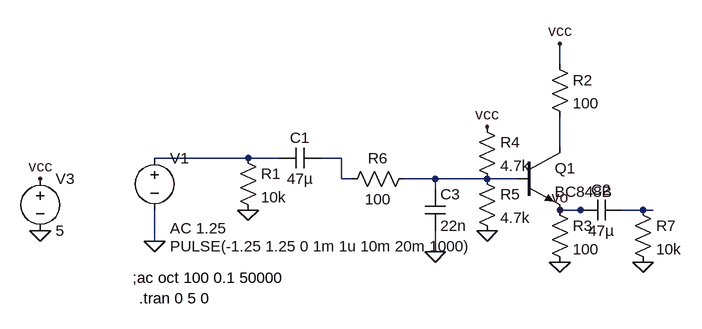
[diagram p0: schematic bandpass-emiterfollower.asc]
bandpass-emiterfollower.asc, the LTspice schematic file:
Version 4
SHEET 1 1756 680
WIRE 592 -80 592 -112
WIRE 592 48 592 0
WIRE 112 64 -32 64
WIRE 160 64 112 64
WIRE 256 64 224 64
WIRE 256 96 256 64
WIRE 272 96 256 96
WIRE 400 96 352 96
WIRE 480 96 400 96
WIRE 528 96 480 96
WIRE 400 112 400 96
WIRE 624 144 592 144
WIRE 640 144 624 144
WIRE 720 144 688 144
WIRE 736 144 720 144
WIRE -32 192 -32 144
WIRE 400 208 400 176
FLAG 592 144 vo
FLAG -32 192 0
FLAG 592 224 0
FLAG 592 -112 vcc
FLAG -208 176 0
FLAG -208 96 vcc
FLAG 480 176 0
FLAG 480 16 vcc
FLAG 112 144 0
FLAG 400 208 0
FLAG 720 224 0
SYMBOL npn 528 48 R0
SYMATTR InstName Q1
SYMATTR Value BC848B
SYMBOL res 576 -96 R0
SYMATTR InstName R2
SYMATTR Value 100
SYMBOL res 576 128 R0
SYMATTR InstName R3
SYMATTR Value 100
SYMBOL voltage -32 48 R0
WINDOW 3 24 152 Left 2
WINDOW 123 24 124 Left 2
WINDOW 39 0 0 Left 0
SYMATTR InstName V1
SYMATTR Value PULSE(-1.25 1.25 0 1m 1u 10m 20m 1000)
SYMATTR Value2 AC 1.25
SYMBOL voltage -208 80 R0
WINDOW 123 0 0 Left 0
WINDOW 39 0 0 Left 0
SYMATTR InstName V3
SYMATTR Value 5
SYMBOL res 464 0 R0
SYMATTR InstName R4
SYMATTR Value 4.7k
SYMATTR SpiceLine tol=1
SYMBOL res 464 80 R0
SYMATTR InstName R5
SYMATTR Value 4.7k
SYMBOL cap 224 48 R90
WINDOW 0 0 32 VBottom 2
WINDOW 3 32 32 VTop 2
SYMATTR InstName C1
SYMATTR Value 47µ
SYMBOL res 96 48 R0
SYMATTR InstName R1
SYMATTR Value 10k
SYMBOL cap 688 128 R90
WINDOW 0 0 32 VBottom 2
WINDOW 3 32 32 VTop 2
SYMATTR InstName C2
SYMATTR Value 47µ
SYMBOL res 368 80 R90
WINDOW 0 0 56 VBottom 2
WINDOW 3 32 56 VTop 2
SYMATTR InstName R6
SYMATTR Value 100
SYMBOL cap 384 112 R0
SYMATTR InstName C3
SYMATTR Value 22n
SYMBOL res 704 128 R0
SYMATTR InstName R7
SYMATTR Value 10k
TEXT -66 248 Left 2 !;ac oct 100 0.1 50000
TEXT -56 280 Left 2 !.tran 0 5 0

The netlist it stands for:
* bandpass-emiterfollower.asc
Q1 N001 N004 vo 0 BC848B
R2 vcc N001 100
R3 vo 0 100
V1 N002 0 PULSE(-1.25 1.25 0 1m 1u 10m 20m 1000) AC 1.25
V3 vcc 0 5
R4 vcc N004 4.7k tol=1
R5 N004 0 4.7k
C1 N003 N002 47µ
R1 N002 0 10k
C2 N005 vo 47µ
R6 N004 N003 100
C3 N004 0 22n
R7 N005 0 10k
.model NPN NPN
.model PNP PNP
.lib standard.bjt
;ac oct 100 0.1 50000
.tran 0 5 0
.backanno
.end